# Altium schematic sheet LCD_FRIDA.SchDoc: LCD_Frida
size A3; Author: N.P; CompanyName: STMicroelectronics; Organization: MCD/APPLICATIONS/LMS; DocumentNumber: MB1260; SheetNumber: 10; SheetTotal: 13; Project: STM32F723e-DISCO; PageSetup: Record=PageOptions|CenterHorizontal=True|CenterVertical=True|PrintScale=1.00|XCorrection=1.00|YCorrection=1.00|PrintKind=1|BorderSize=5000000|LeftOffset=0|BottomOffset=0|Orientation=2|PaperLength=1000|PaperWidth=1000|Scale=100|PaperSource=7|PrintQuality=-3|MediaType=1|DitherType=10|PrintScaleMode=1|PaperKind=Letter|PaperIndex=1
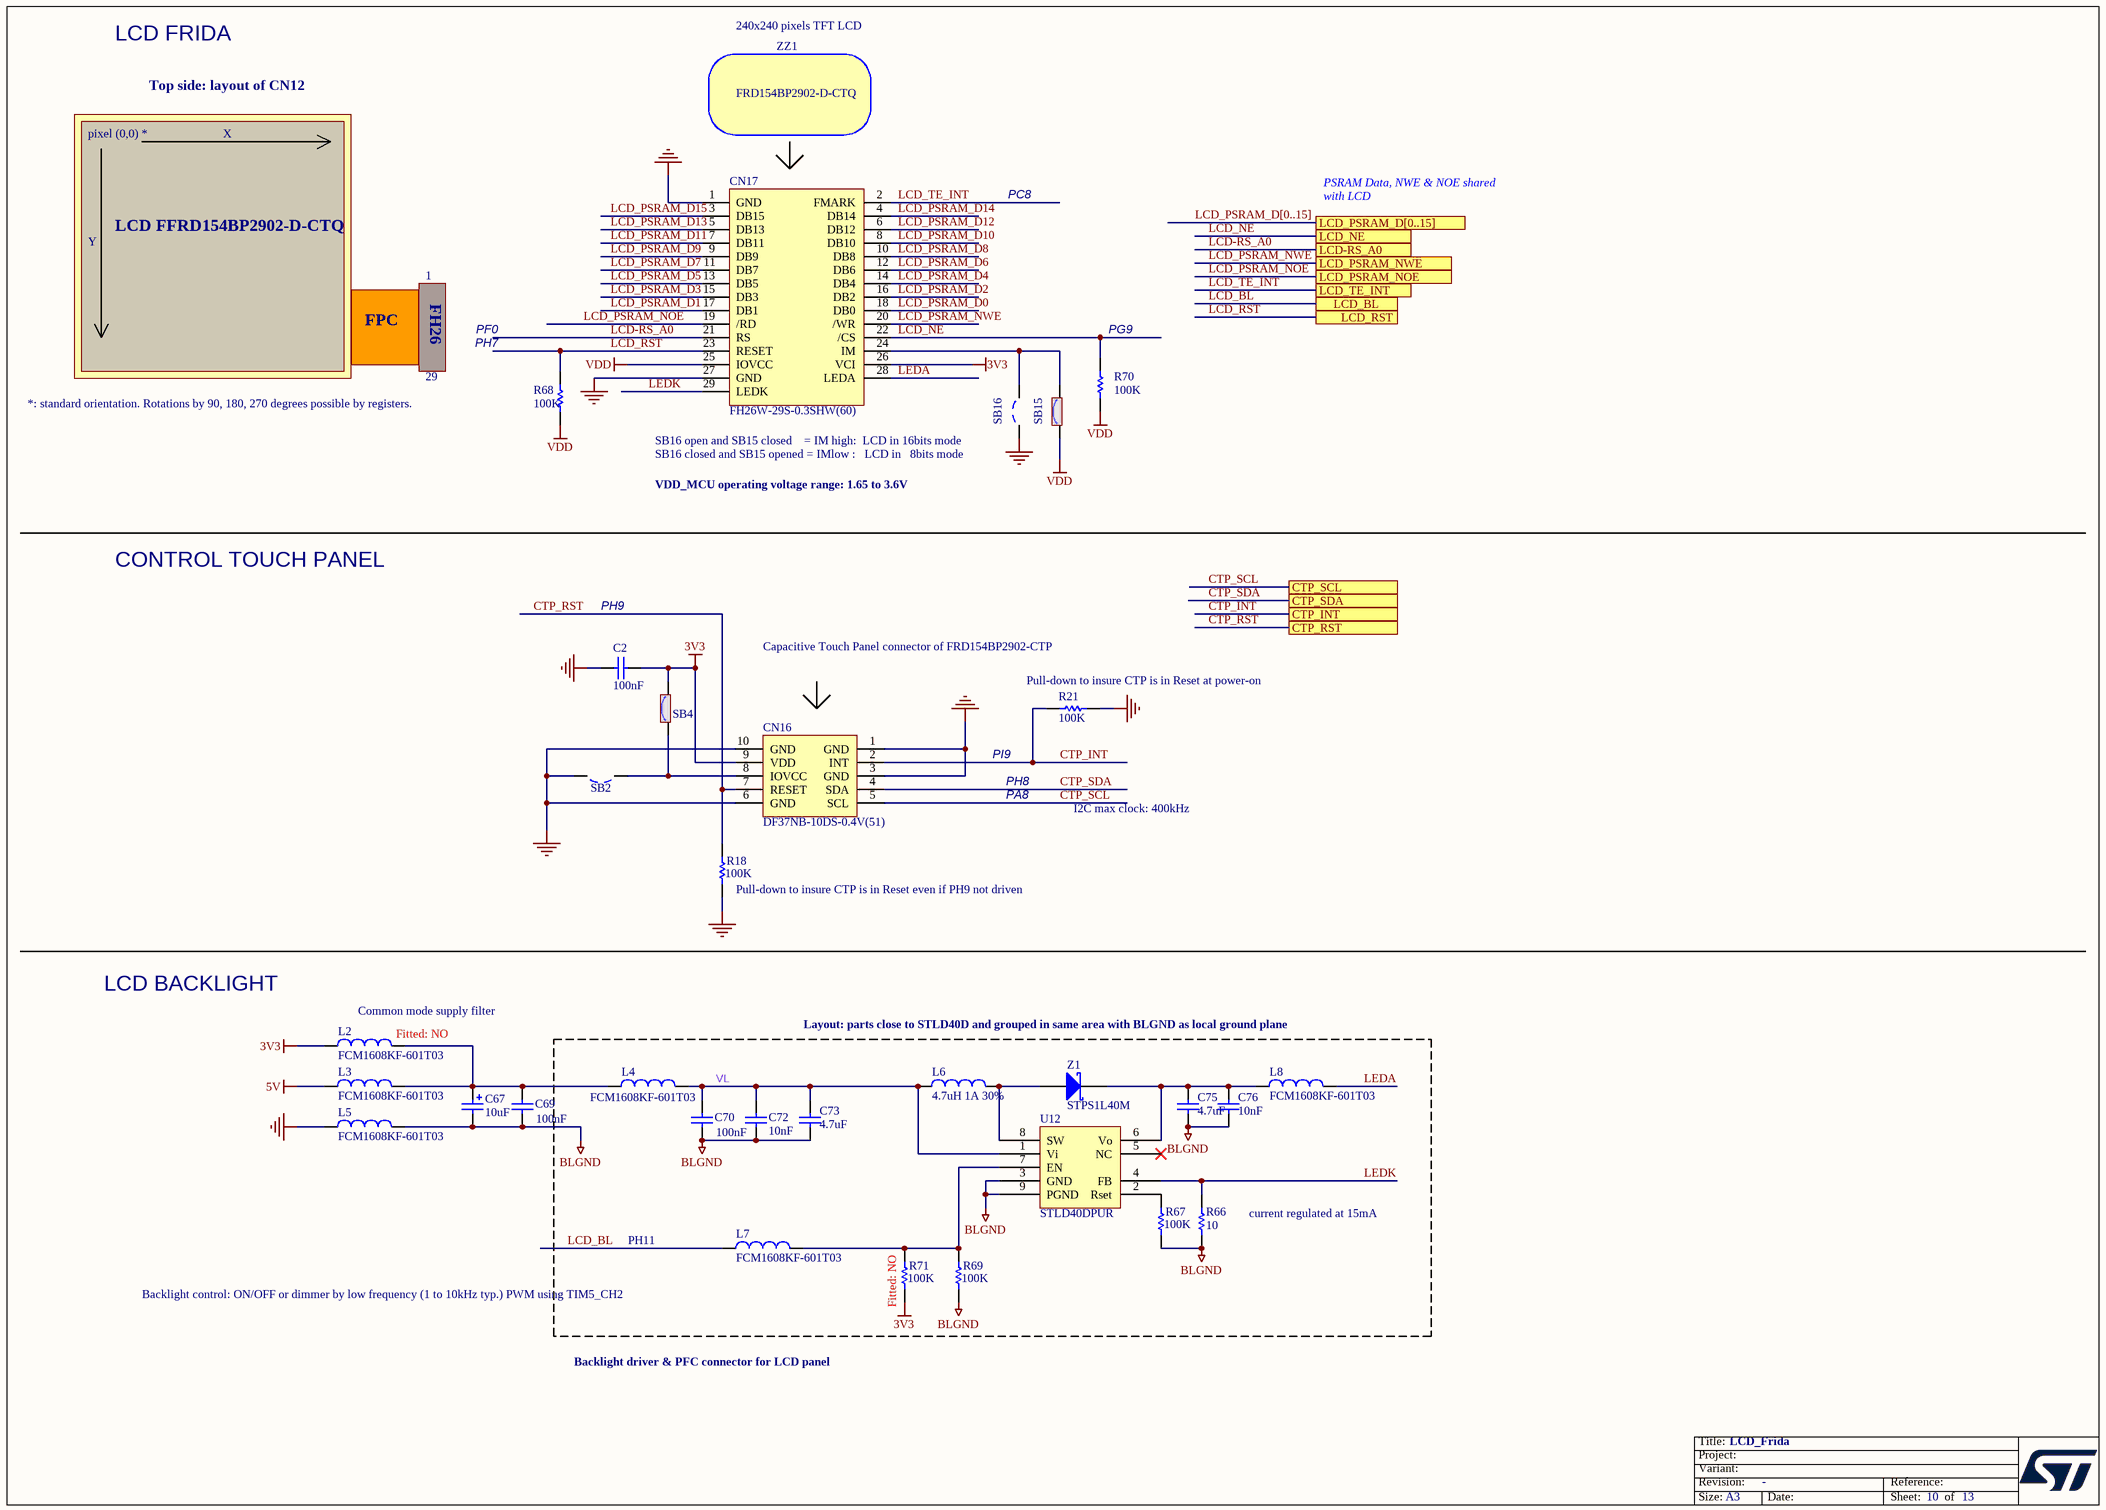
[diagram p0: LCD_FRIDA.SchDoc]

## Parts
C2  100nF  [0402C]
C67  value 10uF  [TAN-A]  (hidden comment: 10uF_POL_10%_TANA)
C69  100nF  [0402C]
C70  100nF  [0402C]
C72  value 10nF  [0603C]  (hidden comment: 10nF_X7R_10%_0603)
C73  value 4.7uF  [1206C]  (hidden comment: 4.7uF_X7R_10%_1206)
C75  value 4.7uF  [1206C]  (hidden comment: 4.7uF_X7R_10%_1206)
C76  value 10nF  [0603C]  (hidden comment: 10nF_X7R_10%_0603)
CN16  DF37NB-10DS-0.4V(51)  [DF37NB-10DS-0R4V]
CN17  FH26W-29S-0.3SHW(60)  [FH26-29S-0R3SHW]
L2  FCM1608KF-601T03  Fitted: NO  [0603L]
L3  FCM1608KF-601T03  [0603L]
L4  FCM1608KF-601T03  [0603L]
L5  FCM1608KF-601T03  [0603L]
L6  4.7uH 1A 30%  [1210L]
L7  FCM1608KF-601T03  [0603L]
L8  FCM1608KF-601T03  [0603L]
R18  value 100K  [0402R]  (hidden comment: 100K_1%_0402)
R21  value 100K  [0402R]  (hidden comment: 100K_1%_0402)
R66  value 10  [0603R]  (hidden comment: 10_1%_0603)
R67  value 100K  [0402R]  (hidden comment: 100K_1%_0402)
R68  value 100K  [0402R]  (hidden comment: 100K_1%_0402)
R69  value 100K  [0402R]  (hidden comment: 100K_1%_0402)
R70  value 100K  [0402R]  (hidden comment: 100K_1%_0402)
R71  value 100K  Fitted: NO  [0402R]  (hidden comment: 100K_1%_0402)
SB2  Solder Bridge OFF  [JP2_SMD]  (value not drawn)
SB4  Solder Bridge ON  [JP2_SMD]  (value not drawn)
SB15  Solder Bridge ON  [JP2_SMD]  (value not drawn)
SB16  Solder Bridge OFF  [JP2_SMD]  (value not drawn)
U12  STLD40DPUR  [SON8_0R65_3X3]
Z1  STPS1L40M  [DO-216AA]
ZZ1  FRD154BP2902-D-CTQ

## Ports
CTP_INT, CTP_RST, CTP_SCL, CTP_SDA, LCD-RS_A0, LCD_BL, LCD_NE, LCD_PSRAM_D[0..15], LCD_PSRAM_NOE, LCD_PSRAM_NWE, LCD_RST, LCD_TE_INT

## Nets
3V3: C2.1 CN16.9(VDD) CN17.26(VCI) L2.1 R71.1 SB4.2
5V: L3.1
BLGND: C67.2 C69.1 C70.1 C72.1 C73.1 C75.1 C76.1 L5.2 R66.1 R67.1 R69.1 U12.3(GND) U12.9(PGND)
GND: C2.2 CN16.1(GND) CN16.3(GND) CN16.6(GND) CN16.10(GND) CN17.1(GND) CN17.27(GND) L5.1 R18.1 R21.1 SB2.2 SB16.1
VDD: CN17.25(IOVCC) R68.1 R70.1 SB15.1
CTP_INT: CN16.2(INT) R21.2 ; port CTP_INT
CTP_RST: CN16.7(RESET) R18.2 ; port CTP_RST
CTP_SCL: CN16.5(SCL) ; port CTP_SCL
CTP_SDA: CN16.4(SDA) ; port CTP_SDA
LCD-RS_A0: CN17.21(RS) ; port LCD-RS_A0
LCD_BL: L7.1 ; port LCD_BL
LCD_NE: CN17.22(/CS) R70.2 ; port LCD_NE
LCD_PSRAM_D0: CN17.18(DB0)
LCD_PSRAM_D1: CN17.17(DB1)
LCD_PSRAM_D2: CN17.16(DB2)
LCD_PSRAM_D3: CN17.15(DB3)
LCD_PSRAM_D4: CN17.14(DB4)
LCD_PSRAM_D5: CN17.13(DB5)
LCD_PSRAM_D6: CN17.12(DB6)
LCD_PSRAM_D7: CN17.11(DB7)
LCD_PSRAM_D8: CN17.10(DB8)
LCD_PSRAM_D9: CN17.9(DB9)
LCD_PSRAM_D10: CN17.8(DB10)
LCD_PSRAM_D11: CN17.7(DB11)
LCD_PSRAM_D12: CN17.6(DB12)
LCD_PSRAM_D13: CN17.5(DB13)
LCD_PSRAM_D14: CN17.4(DB14)
LCD_PSRAM_D15: CN17.3(DB15)
LCD_PSRAM_NOE: CN17.19(/RD) ; port LCD_PSRAM_NOE
LCD_PSRAM_NWE: CN17.20(/WR) ; port LCD_PSRAM_NWE
LCD_RST: CN17.23(RESET) R68.2 ; port LCD_RST
LCD_TE_INT: CN17.2(FMARK) ; port LCD_TE_INT
LEDA: CN17.28(LEDA) L8.2
LEDK: CN17.29(LEDK) R66.2 U12.4(FB)
VL: C70.2 C72.2 C73.2 L4.2 L6.1 U12.1(Vi)
NetC67_1: C67.1 C69.2 L2.2 L3.2 L4.1
NetC75_2: C75.2 C76.2 L8.1 U12.6(Vo) Z1.2(K)
NetCN16_8: CN16.8(IOVCC) SB2.1 SB4.1
NetCN17_24: CN17.24(IM) SB15.2 SB16.2
NetL6_2: L6.2 U12.8(SW) Z1.1(A)
NetL7_2: L7.2 R69.2 R71.2 U12.7(EN)
NetR67_2: R67.2 U12.2(Rset)

Not connected (* = marked no-connect by the designer): U12 5(NC)*

## Buses and harness runs
bus LCD_PSRAM_D[0..15] = port LCD_PSRAM_D[0..15]

## Notes on the sheet
- LCD FRIDA
- 240x240 pixels TFT LCD
- Top side: layout of CN12
- pixel (0,0) *
- X
- Y
- LCD FFRD154BP2902-D-CTQ
- PC8
- PSRAM Data, NWE & NOE shared with LCD
- 1
- FH26
- FPC
- 29
- PF0
- PH7
- (near R70) PG9
- (near R68) *: standard orientation. Rotations by 90, 180, 270 degrees possible by registers.
- SB16 open and SB15 closed    = IM high:  LCD in 16bits mode
  SB16 closed and SB15 opened = IMlow :   LCD in   8bits mode
- VDD_MCU operating voltage range: 1.65 to 3.6V
- CONTROL TOUCH PANEL
- PH9
- Capacitive Touch Panel connector of FRD154BP2902-CTP
- (near R21) Pull-down to insure CTP is in Reset at power-on
- PI9
- PH8
- PA8
- I2C max clock: 400kHz
- (near R18) Pull-down to insure CTP is in Reset even if PH9 not driven
- LCD BACKLIGHT
- (near L2) Common mode supply filter
- Layout: parts close to STLD40D and grouped in same area with BLGND as local ground plane
- PH11
- (near R66) current regulated at 15mA
- Backlight control: ON/OFF or dimmer by low frequency (1 to 10kHz typ.) PWM using TIM5_CH2
- Backlight driver & PFC connector for LCD panel
- Title:
- Project:
- Size:
- Revision:
- Variant:
- A3
- -
- Date:
- Reference:
- Sheet:
- of

## Library data of the parts
C2 C69 C70 = Cap_100nF_X7R_10%_0402: Capacitor,100nF,16V,X7R,10%,0402,YAGEO; Manuf_Part_1: CC0402KRX7R7BB104; Ordered by: Subcon; Fitted: YES; Revision: July-2002: Re-released for DXP Platform.; Value: 100nF; Order: CC0402KRX7R7BB104; Manuf_1: YAGEO; ECCN_US/EU: n/a
C67 = Cap_10uF_POL_10%_TANA: Polarized Capacitor,10uF,10V,10%,typeA,VISHAY; Manuf_Part_1: 293D106X9010A2TE3; Ordered by: Subcon; Fitted: YES; Revision: July-2002: Re-released for DXP Platform.; Manuf_1: VISHAY; Order: *; ECCN_US/EU: n/a
C72 C76 = Cap_10nF_X7R_10%_0603: Capacitor,10nF,50V,X7R,10%,0603,YAGEO; Manuf_Part_1: CC0603KRX7R9BB103; Ordered by: Subcon; Fitted: YES; Revision: July-2002: Re-released for DXP Platform.; Order: CC0603KRX7R9BB103; Manuf_1: YAGEO; ECCN_US/EU: n/a
C73 C75 = Cap_4.7uF_X7R_10%_1206: Capacitor,4.7uF,50V, X7R,10%,1206,AVX; Manuf_Part_1: 12065C475KAT2A; Ordered by: Subcon; Fitted: YES; Revision: July-2002: Re-released for DXP Platform.; Order: *; Manuf_1: AVX; ECCN_US/EU: n/a; Distrib: FARNELL
CN16 = Header 5X2A: Header, 5-Pin, Dual row; Manuf_1: Hirose; Ordered by: Subcon; Fitted: YES; LatestRevisionDate: 17-Jul-2002; LatestRevisionNote: Re-released for DXP Platform.; Publisher: Altium Limited; Manuf_Part_1: DF37NB-10DS-0.4V(51); ECCN_US/EU: n/a
CN17 = FH26-29S-0.3SHW: 29pins FPC connector; Manuf_1: Hirose; Ordered by: Subcon; Fitted: YES; Manuf_Part_1: FH26W-29S-0.3SHW(60); ECCN_US/EU: n/a
L2 = BEAD_600R_350MA_0603: Bead,600R,350mA,0603,FCM1608KF-601T03,Tai-tech; Manuf_2: TDK; Manuf_Part_2: MPZ1608S300A; Manuf_Part_3: BLM18PG121SN1D; Manuf_3: MURATA; Value: 100uH; Description_2: Bead,30R,5A,0603,MPZ1608S300A,TDK; Description_3: Bead,120R,2A,0603,BLM18PG121SN1D,MURATA; Fitted: NO; Ordered by: Subcon; Revision: July-2002: Re-released for DXP Platform.; Manuf_Part_1: FCM1608KF-601T03; Manuf_1: Tai-tech; ECCN_US/EU: n/a
L3-L5 L7 L8 = BEAD_600R_350MA_0603: Bead,600R,350mA,0603,FCM1608KF-601T03,Tai-tech; Manuf_2: TDK; Manuf_Part_2: MPZ1608S300A; Manuf_Part_3: BLM18PG121SN1D; Manuf_3: MURATA; Value: 100uH; Description_2: Bead,30R,5A,0603,MPZ1608S300A,TDK; Description_3: Bead,120R,2A,0603,BLM18PG121SN1D,MURATA; Ordered by: Subcon; Fitted: YES; Revision: July-2002: Re-released for DXP Platform.; Manuf_Part_1: FCM1608KF-601T03; Manuf_1: Tai-tech; ECCN_US/EU: n/a
L6 = Ind_4.7uH_1A_30%: FIXED IND 4.7UH 1A 180 MOHM 30% SMD; Manuf_Part_1: LQH32PN4R7NN0L; Manuf_1: MURATA; Order: 490-5338-1-ND; Ordered by: Subcon; Fitted: YES; Distrib: DIGIKEY; ECCN_US/EU: n/a
R18 R21 R67-R70 = Res_100K_1%_0402: Resistor,100K,0402,1%,YAGEO; Manuf_Part_2: RT0402FRE07100KL; Manuf_Part_1: RC0402FR-07100KL; Ordered by: Subcon; Fitted: YES; Manuf_1: YAGEO; ECCN_US/EU: n/a; Manuf_2: YAGEO
R66 = Res_10_1%_0603: Resistor,10,0603,1%,ROHM,1/4W; Manuf_Part_1: ESR03EZPF10R0; Ordered by: Subcon; Fitted: YES; Manuf_1: ROHM; Order: *; ECCN_US/EU: n/a
R71 = Res_100K_1%_0402: Resistor,100K,0402,1%,YAGEO; Manuf_Part_2: RT0402FRE07100KL; Manuf_Part_1: RC0402FR-07100KL; Ordered by: Subcon; Manuf_1: YAGEO; ECCN_US/EU: n/a; Manuf_2: YAGEO
SB2 SB16 = SB_OFF: Fitted: NO; Ordered by: Subcon; Revision: July-2002: Re-released for DXP Platform.; ECCN_US/EU: n/a
SB4 SB15 = SB_ON: Fitted: YES; Ordered by: Subcon; Revision: July-2002: Re-released for DXP Platform.; ECCN_US/EU: n/a
U12 = STLD40DPMR: White LED power supply for large display backlight; Manuf_1: STM; Ordered by: ST; Ref St: 9176009; ECCN_US/EU: EAR99/NEC; Fitted: YES; Manuf_Part_1: STLD40DPUR; Provided: ST; Distrib: ST
Z1 = D Schottky: Schottky Diode; Manuf_1: STM; Code - JEDEC: DO-214-AA; Ordered by: ST; Ref St: 9151085; ECCN_US/EU: EAR99/NEC; Fitted: YES; Published: 8-Jun-2000; Revision: July-2002: Re-released for DXP Platform.; Publisher: Altium Limited; Manuf_Part_1: STPS1L40M; Distrib: ST; Provided: ST
ZZ1 = BoM_Item: Frida LCD + Capacitive Touch Panel; Manuf_Part_1: FRD154BP2902-CTP; Ordered by: Subcon; ECCN_US/EU: EAR99/NEC; Fitted: YES; Manuf_1: FRIDA